# Altium schematic sheet TestPoints.SchDoc: Test Points
size Tabloid; Date: 02/08/2023; Engineer: Terry D. Schevker; Revision: 1.0; SheetNumber: 7; SheetTotal: 8
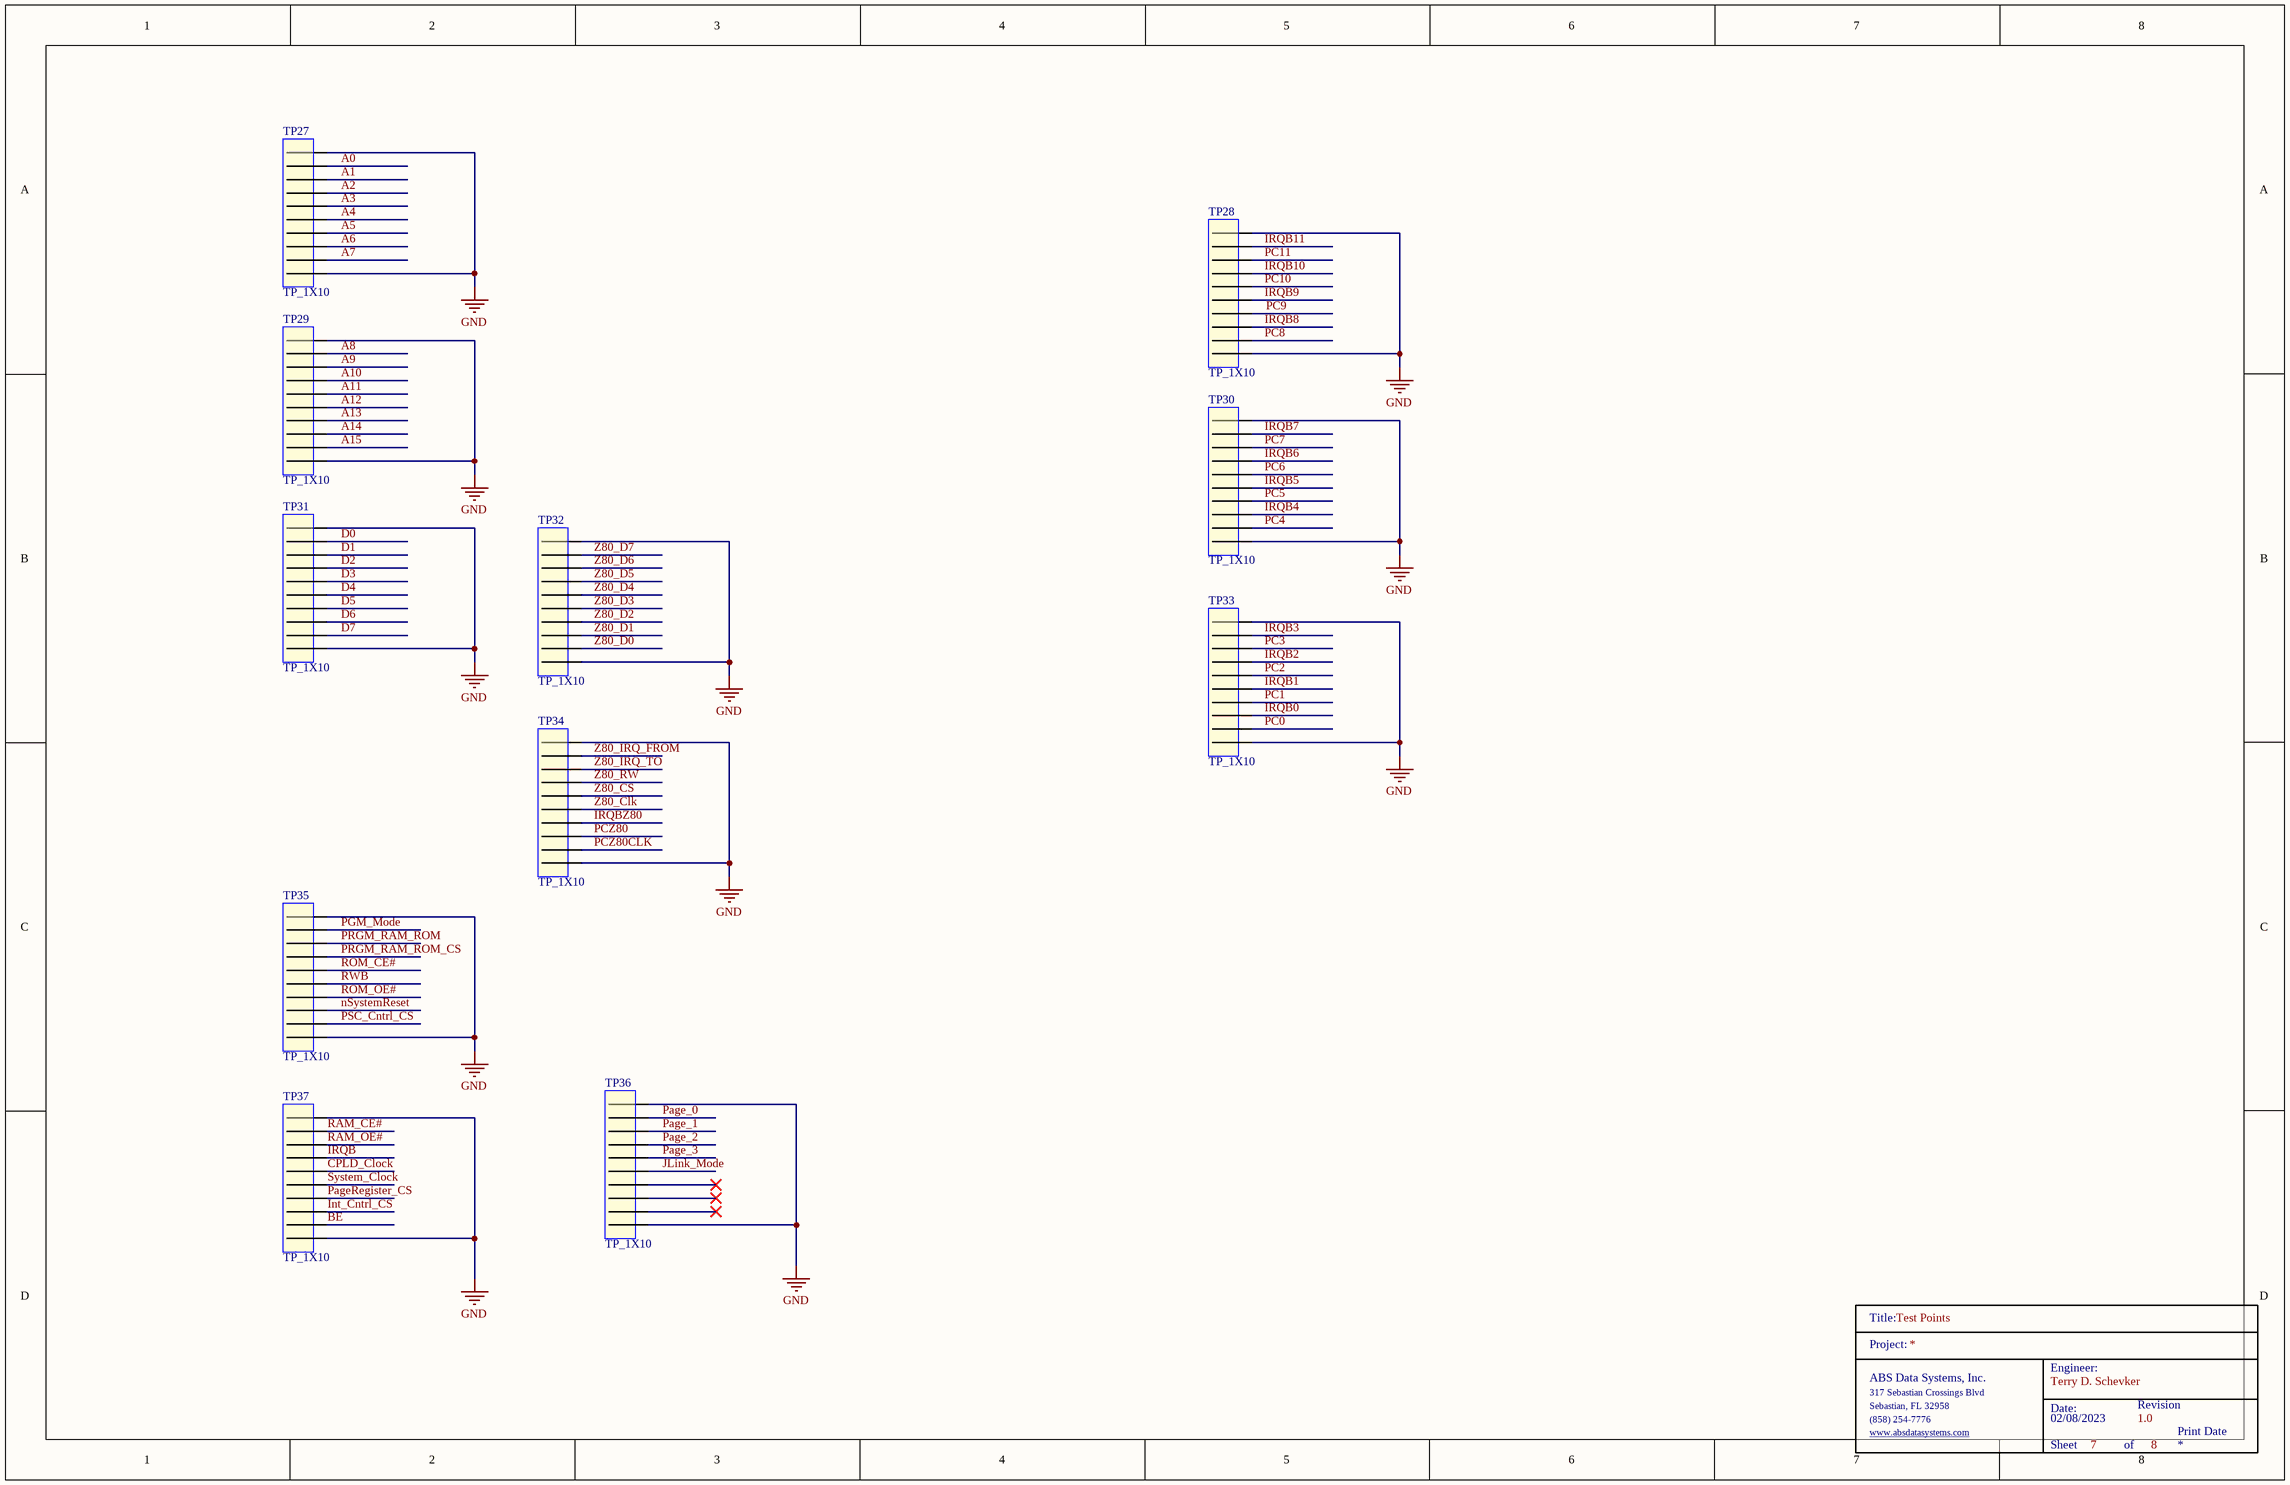
[diagram p0: TestPoints.SchDoc]

## Parts
TitleBlock_5  TitleBlock  (value not drawn)  (graphical)
TP27  TP_1X10  [TP_1X10]
TP28  TP_1X10  [TP_1X10]
TP29  TP_1X10  [TP_1X10]
TP30  TP_1X10  [TP_1X10]
TP31  TP_1X10  [TP_1X10]
TP32  TP_1X10  [TP_1X10]
TP33  TP_1X10  [TP_1X10]
TP34  TP_1X10  [TP_1X10]
TP35  TP_1X10  [TP_1X10]
TP36  TP_1X10  [TP_1X10]
TP37  TP_1X10  [TP_1X10]

## Nets
GND: TP27.1 TP27.10 TP28.1 TP28.10 TP29.1 TP29.10 TP30.1 TP30.10 TP31.1 TP31.10 TP32.1 TP32.10 TP33.1 TP33.10 TP34.1 TP34.10 TP35.1 TP35.10 TP36.1 TP36.10 TP37.1 TP37.10
A0: TP27.2
A1: TP27.3
A2: TP27.4
A3: TP27.5
A4: TP27.6
A5: TP27.7
A6: TP27.8
A7: TP27.9
A8: TP29.2
A9: TP29.3
A10: TP29.4
A11: TP29.5
A12: TP29.6
A13: TP29.7
A14: TP29.8
A15: TP29.9
BE: TP37.9
CPLD_Clock: TP37.5
D0: TP31.2
D1: TP31.3
D2: TP31.4
D3: TP31.5
D4: TP31.6
D5: TP31.7
D6: TP31.8
D7: TP31.9
Int_Cntrl_CS: TP37.8
IRQB: TP37.4
IRQB0: TP33.8
IRQB1: TP33.6
IRQB2: TP33.4
IRQB3: TP33.2
IRQB4: TP30.8
IRQB5: TP30.6
IRQB6: TP30.4
IRQB7: TP30.2
IRQB8: TP28.8
IRQB9: TP28.6
IRQB10: TP28.4
IRQB11: TP28.2
IRQBZ80: TP34.7
JLink_Mode: TP36.6
nSystemReset: TP35.8
Page_0: TP36.2
Page_1: TP36.3
Page_2: TP36.4
Page_3: TP36.5
PageRegister_CS: TP37.7
PC0: TP33.9
PC1: TP33.7
PC2: TP33.5
PC3: TP33.3
PC4: TP30.9
PC5: TP30.7
PC6: TP30.5
PC7: TP30.3
PC8: TP28.9
PC9: TP28.7
PC10: TP28.5
PC11: TP28.3
PCZ80: TP34.8
PCZ80CLK: TP34.9
PGM_Mode: TP35.2
PRGM_RAM_ROM: TP35.3
PRGM_RAM_ROM_CS: TP35.4
PSC_Cntrl_CS: TP35.9
RAM_CE#: TP37.2
RAM_OE#: TP37.3
ROM_CE#: TP35.5
ROM_OE#: TP35.7
RWB: TP35.6
System_Clock: TP37.6
Z80_Clk: TP34.6
Z80_CS: TP34.5
Z80_D0: TP32.9
Z80_D1: TP32.8
Z80_D2: TP32.7
Z80_D3: TP32.6
Z80_D4: TP32.5
Z80_D5: TP32.4
Z80_D6: TP32.3
Z80_D7: TP32.2
Z80_IRQ_FROM: TP34.2
Z80_IRQ_TO: TP34.3
Z80_RW: TP34.4

Not connected (* = marked no-connect by the designer): TP36 7* 8* 9*

## Notes on the sheet
- Print Date
- (in symbol TitleBlock) Title:; Project:; Engineer:; ABS Data Systems, Inc.; 317 Sebastian Crossings Blvd; Sebastian, FL 32958; Date:; Revision; (858) 254-7776; www.absdatasystems.com; Sheet; of

## Library data of the parts
TP27-TP37 = TP_1X10: Manufacturer: Samtec; Manufacturer Part Number: TST-105-01-G-D; Number of Contacts: 16; Gender: Male; Connector Type: Male Pin; Pitch: 2.54mm; Row Spacing: 0.1inch; Supplier 1: Digi-Key; RoHS: Yes; Category: Headers and Wire Housings; Stock 1: 227; Pricing 1: 1=2.85000, 10=2.73600, 100=2.28000, 500=1.93800, 1000=1.65300, 5000=1.48200 (USD); Mount: Through Hole; Contact Plating: Gold; Contact Material: Bronze; Housing Material: Polyester; Housing Color: Black; Color: Black; Min Operating Temperature: -55°C; Max Operating Temperature: 125°C; Number of Rows: 2; Termination: Solder; Packaging: Rail/Tube; Orientation: Straight; Number of Positions: 16; Length: 27.94mm; Depth: 9.27mm; Contact Mating Length: 0.25inch; REACH SVHC: No SVHC; ComponentLink1URL: https://datasheet.ciiva.com/739/tst-mkt-739845.pdf?src-supplier=Digi-Key; ComponentLink1Description: https://datasheet.ciiva.com/739/tst-mkt-739845.pdf?src-supplier=Digi-Key; ComponentLink2URL: https://datasheet.ciiva.com/10018/htst-10018510.pdf?src-supplier=Avnet; ComponentLink2Description: https://datasheet.ciiva.com/10018/htst-10018510.pdf?src-supplier=Avnet